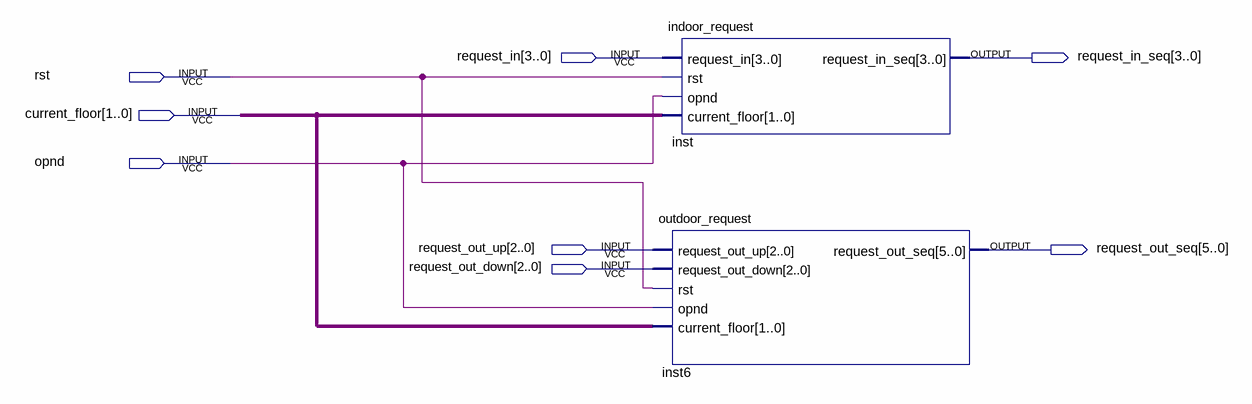
[diagram p0: schematic sheet]
// Quartus schematic floor.bdf as structural Verilog: 2 symbols, 8 pins
module floor (
  input  [3:0] request_in,
  input  rst,
  input  [1:0] current_floor,
  input  opnd,
  input  [2:0] request_out_up,
  input  [2:0] request_out_down,
  output [3:0] request_in_seq,
  output [5:0] request_out_seq
);

  indoor_request inst (
    .request_in(request_in), .rst(rst), .opnd(opnd), .current_floor(current_floor),
    .request_in_seq(request_in_seq));
  outdoor_request inst6 (
    .request_out_up(request_out_up), .request_out_down(request_out_down), .rst(rst), .opnd(opnd),
    .current_floor(current_floor), .request_out_seq(request_out_seq));
endmodule
